# EAGLE schematic Project11 Schematic (EAGLE 7.3.0)
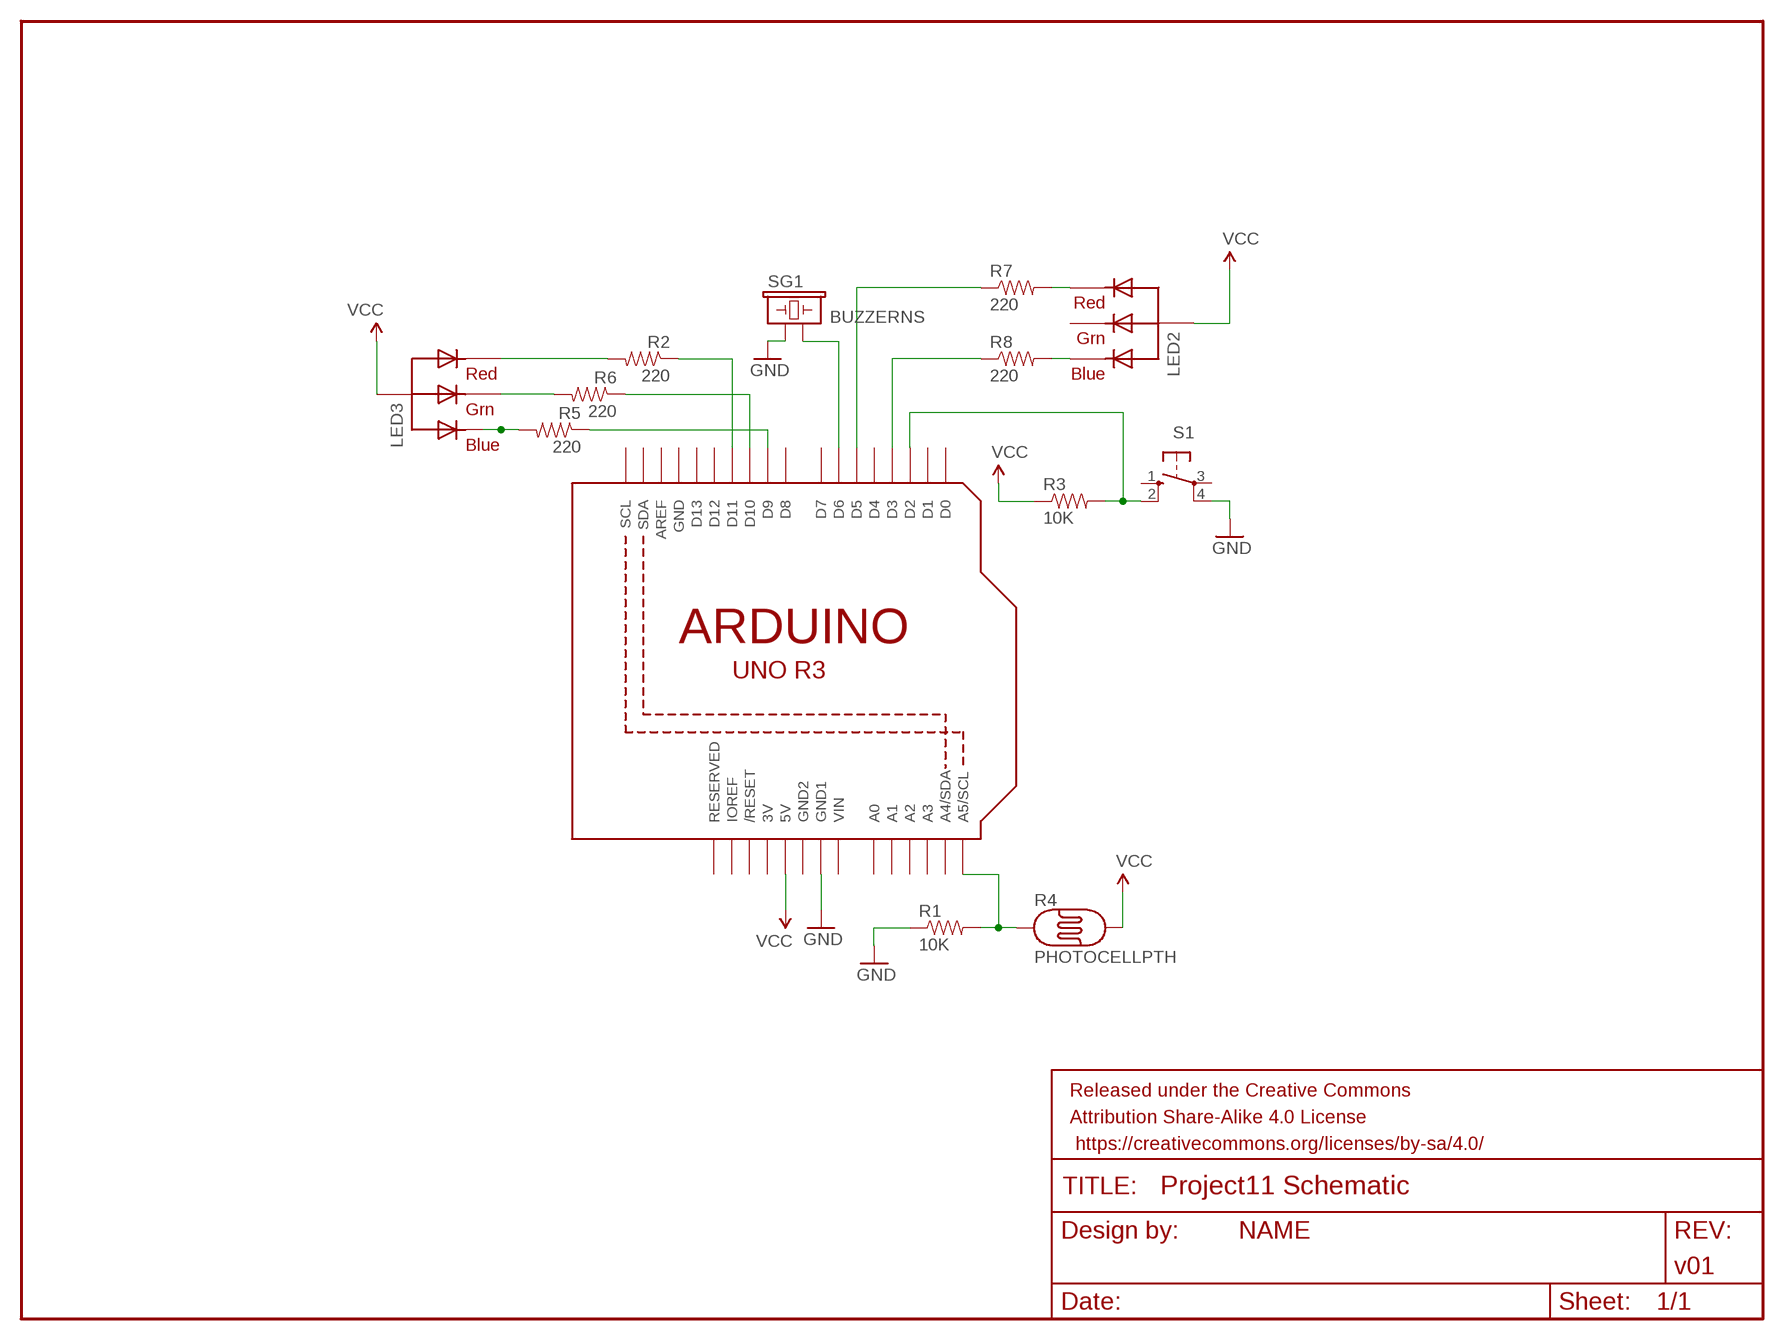
[diagram p0: schematic, sheet 1]

## Parts
FRAME1  FRAME-LETTER  [CREATIVE_COMMONS]
LED2  RGBLED_CA-5MM  [LED5MMRGB]
LED3  RGBLED_CA-5MM  [LED5MMRGB]
R1  10K  RESISTOR0402-RES  [0402-RES]
R2  220  RESISTOR0402-RES  [0402-RES]
R3  10K  RESISTOR0402-RES  [0402-RES]
R4  PHOTOCELLPTH  [PHOTOCELL]
R5  220  RESISTOR0402-RES  [0402-RES]
R6  220  RESISTOR0402-RES  [0402-RES]
R7  220  RESISTOR0402-RES  [0402-RES]
R8  220  RESISTOR0402-RES  [0402-RES]
S1  40-XX  [B3F-40XX]
SG1  BUZZERNS  [BUZZER-12MM-NS]
U1  ARDUINOR3-BPLACE  [ARDUINOR3-BPLACE]

## Nets
A5: R1.2 R4.1 U1.A5(A5/SCL)
D2: R3.2 S1.2(S1) U1.D2
D5: R7.1 U1.D5
D9: R5.1 U1.D9
D10: R6.1 U1.D10
GND: R1.1 S1.4(P1) SG1.+ U1.GND1
N$1: LED3.1(RED) R2.2
N$2: LED3.3(GREEN) R6.2
N$3: LED3.4(BLUE) R5.2
N$4: LED2.1(RED) R7.2
N$5: LED2.4(BLUE) R8.2
N$6: R2.1 U1.D11
N$7: SG1.- U1.D6
N$8: R8.1 U1.D3
VCC: LED2.2(VCC) LED3.2(VCC) R3.1 R4.2 U1.5V
Unconnected: LED2.3(GREEN) S1.1(S) S1.3(P) U1.A0 U1.A1 U1.A2 U1.A3 U1.A4(A4/SDA) U1.AREF U1.D0 U1.D1 U1.D4 U1.D7 U1.D8 U1.D12 U1.D13 U1.IOREF U1.RESERVED U1.RESET(/RESET) U1.SCL U1.SDA

## Power pins joined to a net without a drawn wire
3V: U1.3V
GND: U1.GND
GND2: U1.GND2
VIN: U1.VIN

## Library data of the parts
FRAME1 = SparkFun-Aesthetics:FRAME-LETTER: Schematic Frame Standard 8.5x11 US Letter frame; DESIGNER: NAME; VERSION: v01
LED2 LED3 = adafruit:RGBLED_CA: RGB LED, common-anode 5MM Staggered pins 5mm Piranha package http://www.ladyada.net/library/pcb/eaglelibrary.html
R1-R3 R5-R8 = SparkFun-Passives:RESISTOR: Resistor Basic schematic elements and footprints for 0603, 1206, and PTH resistors.
R4 = SparkFun-Sensors:PHOTOCELL: CdS photoresistor. This is a low cost way to detect light levels. Resistance decreases with more incoming light. SparkFun SKU: SEN-09088
S1 = adafruit:40-XX: OMRON SWITCH; MF: OMRON COMPONENTS USA; MPN: B3F-4000; OC_FARNELL: 176434; OC_NEWARK: 36K3105
SG1 = SparkFun-Electromechanical:BUZZER: Buzzer 12mm Spark Fun Electronics SKU : Comp-Buzzer
U1 = adafruit:ARDUINOR3: This is a new object for the new Arduino R3 - with extra pins that you may want to use (such as IOref, and duplicated A4/A5